# EAGLE design RegulatorBoard (EAGLE 5.12)
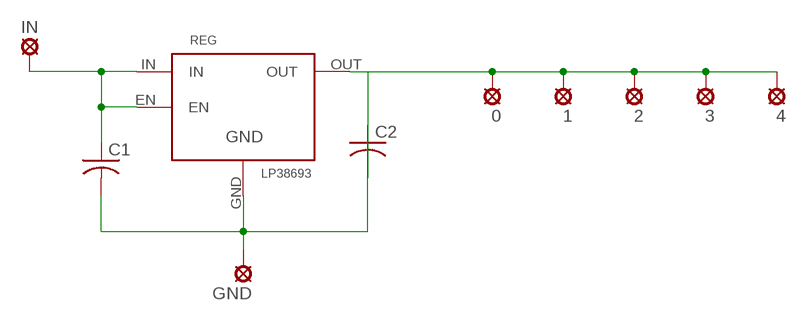
[diagram p0: schematic, sheet 1]

## Parts
0  LSP13  [LSP13]
1  LSP13  [LSP13]
2  LSP13  [LSP13]
3  LSP13  [LSP13]
4  LSP13  [LSP13]
C1  C-USC0402  [C0402]
C2  C-USC0402  [C0402]
GND  LSP13  [LSP13]
IN  LSP13  [LSP13]
REG  LP38693  [MPDS385]

## Nets
GND: C1.2 C2.1 GND.MP REG.GND
IN: C1.1 IN.MP REG.EN REG.IN
OUT: 0.MP 1.MP 2.MP 3.MP 4.MP C2.2 REG.OUT

## Library data of the parts
0 1-4 GND IN = solpad:LSP13: SOLDER PAD drill 1.3 mm, distributor Buerklin, 12H562
C1 C2 = rcl:C-US: CAPACITOR, American symbol
REG = linear:LP38693

## Board
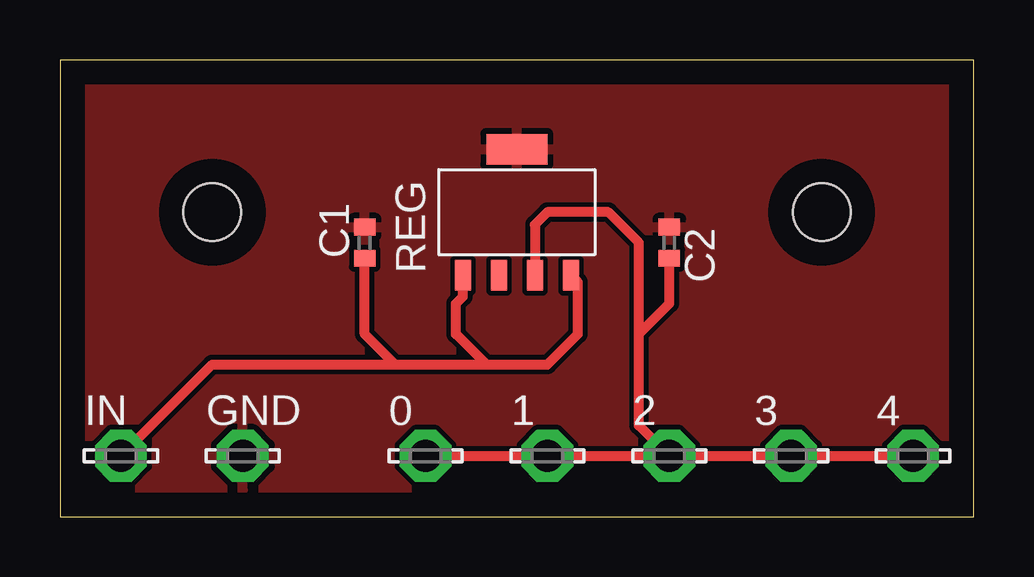
[diagram p1: board, top side]

Size 38.1 x 19.05 mm. Coordinates in mm from the lower left corner, seen from the top.
Outline: 0,0 38.1,0 38.1,19.05 0,19.05 0,0
Copper layers (1*16): Top 0.035mm / dielectric 1.5mm / Bottom 0.035mm
Design rules "default": minimum track width 10mil, minimum drill 24mil, track to track 8mil, track to pad 8mil, pad to pad 8mil, via to via 8mil, smd to smd 8mil, copper to edge 40mil, drill to drill 8mil, minimum pad ring 10mil, minimum via ring 8mil, stop-mask expansion 4mil, vias tented up to drill 0mil, thermal gap 10mil
Holes 2.4 mm at 6.35,12.7 31.75,12.7

### Footprints (pad centres in the part's own frame; a part is rotated, then mirrored left to right if it is on the bottom)
LSP13 = drill 1.321 pad 2.159 octagon: MP 0,0
C0402 = smd 0.7 x 0.9: 1 -0.65,0; 2 0.65,0
MPDS385 = smd 1.27 x 0.66: EN -2.63,2.25; IN -2.63,-2.25; NC -2.63,0.75; OUT -2.63,-0.75 | smd 1.27 x 2.54: GND 2.63,0

### Placement (x,y rotation side)
0  15.24,2.54 0 top
1  20.32,2.54 0 top
2  25.4,2.54 0 top
3  30.48,2.54 0 top
4  35.56,2.54 0 top
C1  12.7,11.43 90 top
C2  25.4,11.43 270 top
GND  7.62,2.54 0 top
IN  2.54,2.54 0 top
REG  19.05,12.7 90 top

### Tracks (layer width: path | path; a pad name or v marks a point on that pad's centre or on a via)
GND
  pour Top: 0,19.05 0,0 38.1,0 38.1,19.05
IN
  Top 0.406: REG.EN 16.8,9.18 16.51,8.89 16.51,7.62 17.78,6.35 | 17.78,6.35 20.32,6.35 21.59,7.62 21.59,9.78 REG.IN | C1.1 12.7,7.62 13.97,6.35 | 13.97,6.35 17.78,6.35 | IN.MP 6.35,6.35 13.97,6.35
OUT
  Top 0.406: REG.OUT 19.8,12.18 20.32,12.7 22.86,12.7 24.13,11.43 24.13,7.62 | 2.MP 24.13,3.81 24.13,7.62 | 0.MP 1.MP 2.MP | 2.MP 3.MP 4.MP | C2.2 25.4,8.89 24.13,7.62